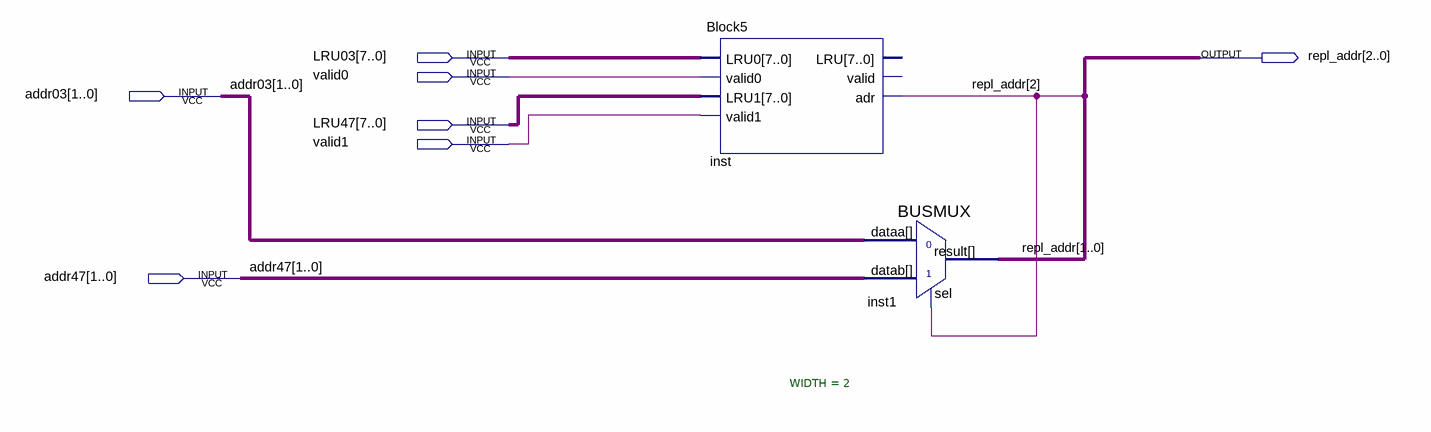
[diagram p0: schematic sheet]
// Quartus schematic CMP48.bdf as structural Verilog: 2 symbols, 7 pins
module CMP48 (
  input  [7:0] LRU03,
  input  valid0,
  input  [1:0] addr03,
  input  [7:0] LRU47,
  input  valid1,
  input  [1:0] addr47,
  output [2:0] repl_addr
);

  Block5 inst (.LRU0(LRU03), .valid0(valid0), .LRU1(LRU47), .valid1(valid1), .adr(repl_addr[2]));  // open: LRU, valid
  BUSMUX #(.WIDTH(2)) inst1 (.datab(addr47), .sel(repl_addr[2]), .dataa(addr03), .result(repl_addr[1:0]));
endmodule
